# Altium project ts_20-Telemtry-Unit.PrjPcb
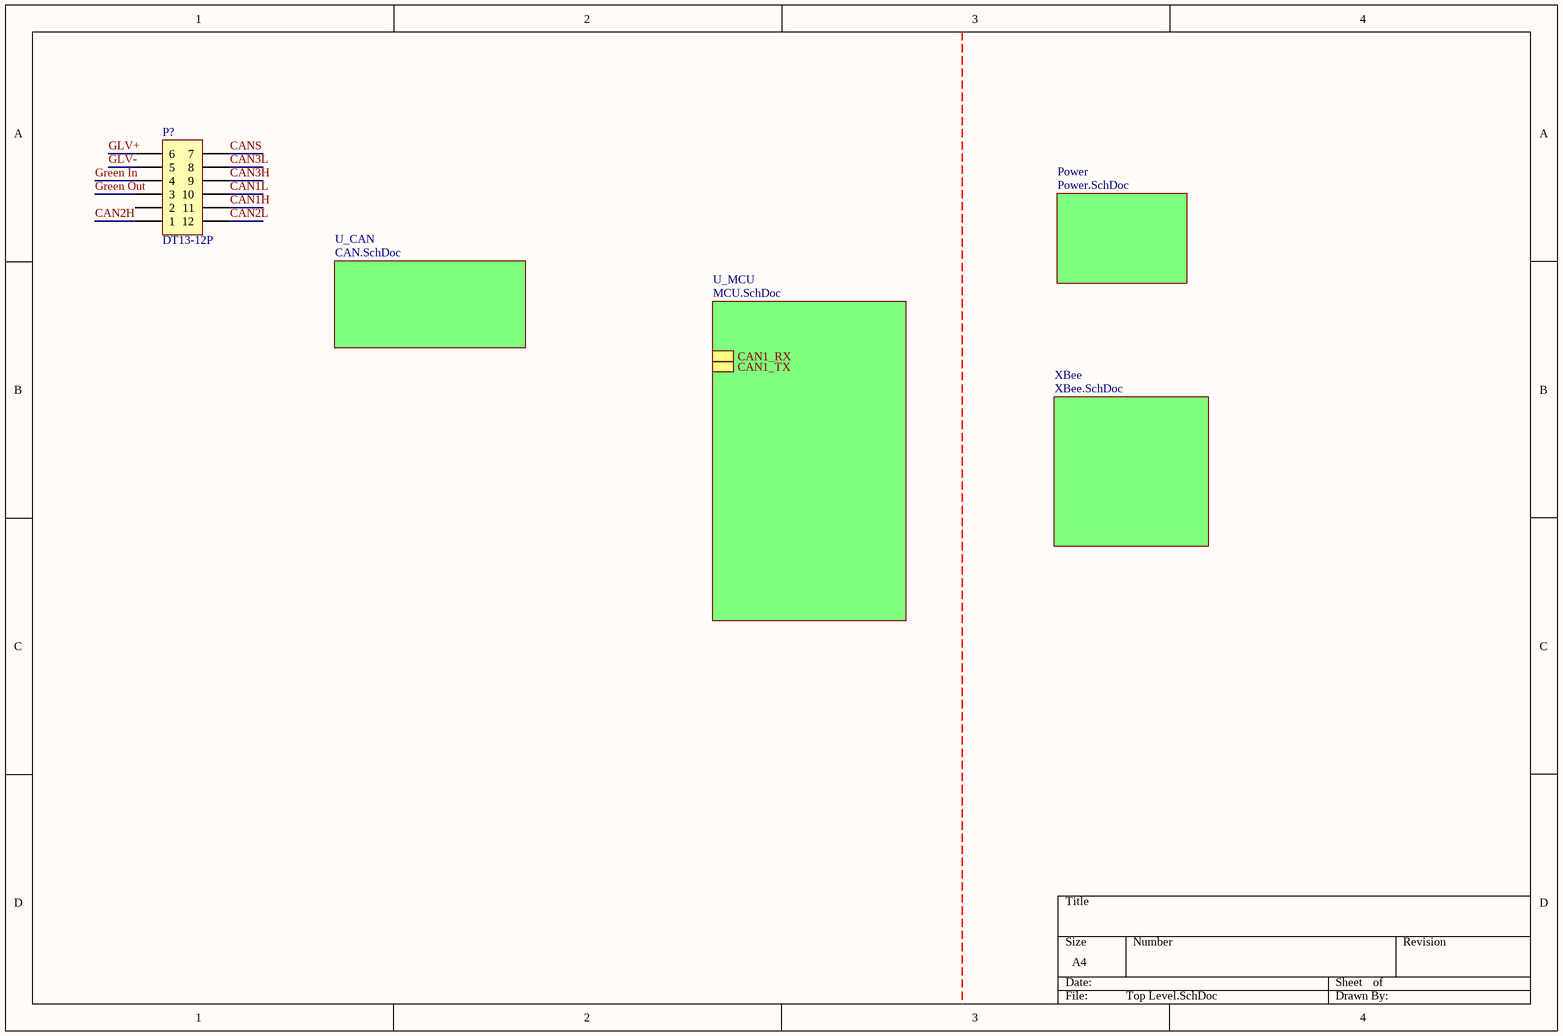
[diagram p0: Top Level.SchDoc]
5 sheets, 13 parts. Net scope: hierarchical (ports join the sheet entries above them; power ports are global).
Sheets:
  Top Level.SchDoc
    U_CAN = CAN.SchDoc
    U_MCU = MCU.SchDoc
    Power = Power.SchDoc
    XBee = XBee.SchDoc

## Sheet Top Level.SchDoc
size A4; SheetNumber: 1; SheetTotal: 5

### Parts
P?  DT13-12P  [DT13-12P]

### Sub-sheets
Power = Power.SchDoc: no entries
U_CAN = CAN.SchDoc: no entries
U_MCU = MCU.SchDoc: CAN1_RX, CAN1_TX
XBee = XBee.SchDoc: no entries

### Nets
CAN1H: P?.11
CAN1L: P?.10
CAN2H: P?.1
CAN2L: P?.12
CAN3H: P?.9
CAN3L: P?.8
CANS: P?.7
GLV+: P?.6
GLV-: P?.5
Green In: P?.4
Green Out: P?.3

Not connected (* = marked no-connect by the designer): P? 2

### Library data of the parts
P? = DT13-12P: Positions: 12; Pitch: 4.44mm; Row Spacing: 6.35mm; Angle: 90; Flange: Yes; Contact: Nickel; Part Number: DT13-12P; Digikey Part Number: 1734-1451-ND; Digikey Link: https://www.digikey.com.au/product-detail/en/te-connectivity-deutsch-connectors/DT13-12PA/1734-1451-ND/7220123

## Sheet CAN.SchDoc
size A4; SheetNumber: 2; SheetTotal: 2

## Sheet MCU.SchDoc
size A4; SheetNumber: 3; SheetTotal: 5
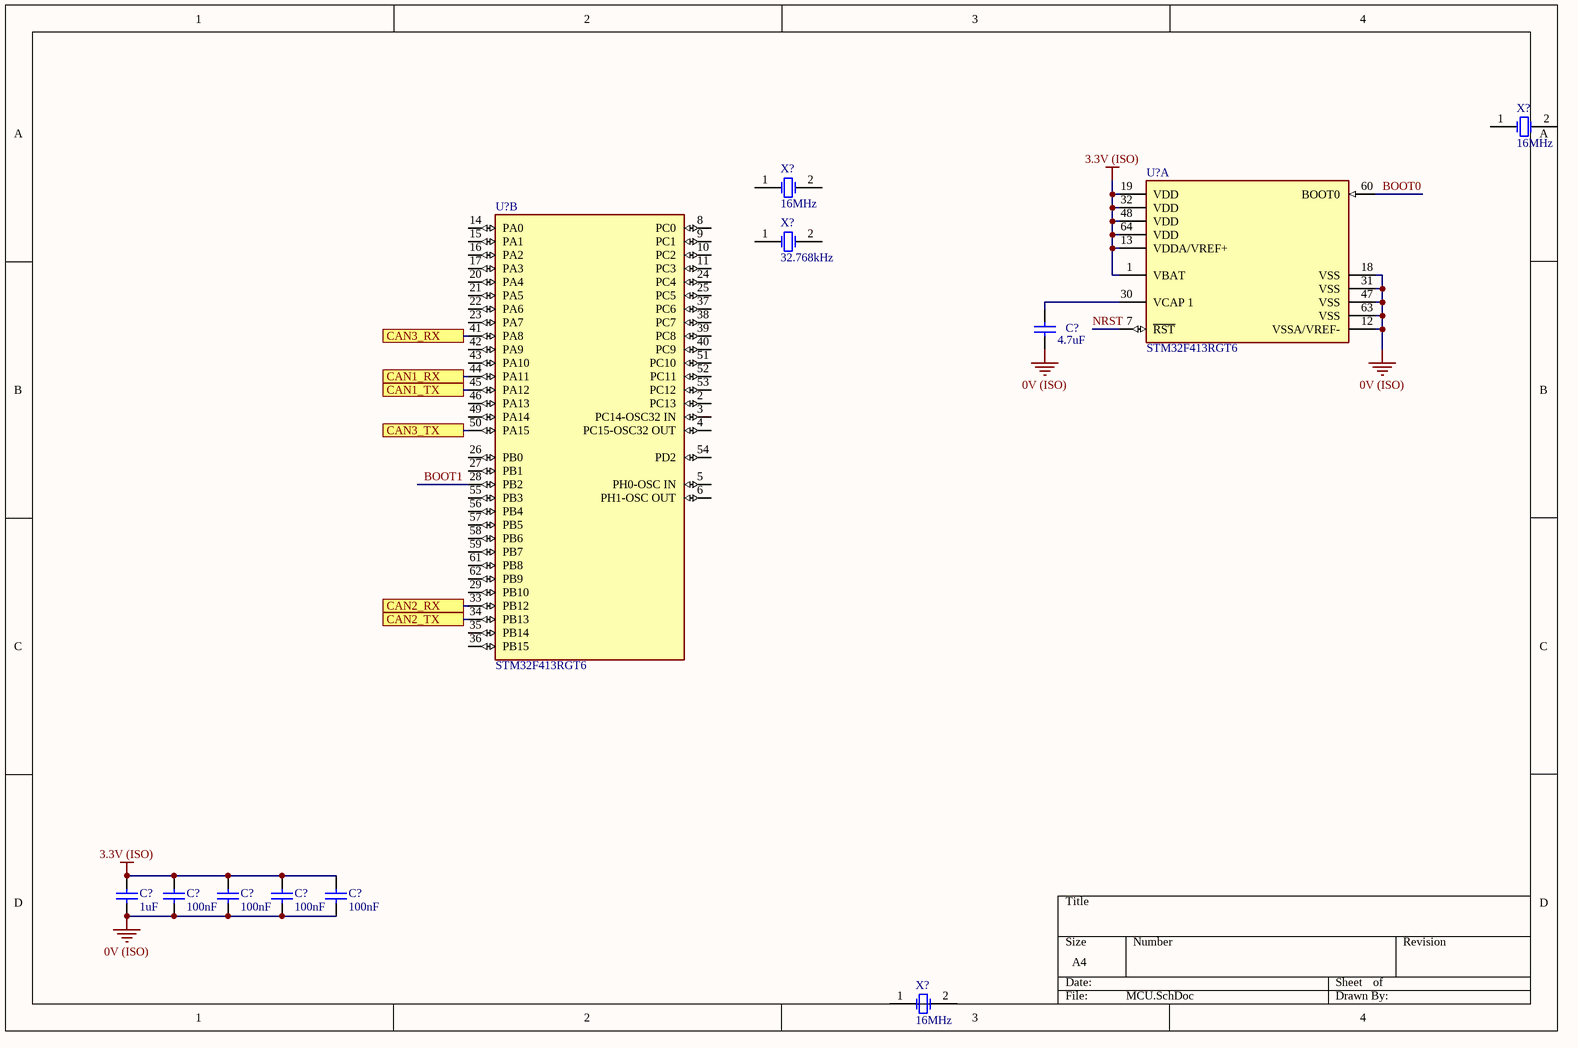
[diagram p1: MCU.SchDoc]

### Parts
(Parts that share a designator on the sheet are numbered #1, #2 ... from top to bottom, then left to right.)
C?#1  4.7uF  [0805]
C?#2  1uF  [0805]
C?#3  100nF  [0805]
C?#4  100nF  [0805]
C?#5  100nF  [0805]
C?#6  100nF  [0805]
U?#1  STM32F413RGT6  [FP-LQFP64-5W-MFG]  (part A of 2)
U?#2  STM32F413RGT6  [FP-LQFP64-5W-MFG]  (part B of 2)
X?#1  16MHz  [Abracon HC-49/US]
X?#2  16MHz  [Abracon HC-49/US]
X?#3  32.768kHz  [EPSON 2-SMD]
X?#4  16MHz  [Abracon HC-49/US]

### Ports
CAN1_RX, CAN1_TX, CAN2_RX, CAN2_TX, CAN3_RX, CAN3_TX

### Nets
0V (ISO): C?#1.2 C?#2.1 C?#3.1 C?#4.1 C?#5.1 C?#6.1 U?#1.12(VSSA/VREF-) U?#1.18(VSS) U?#1.31(VSS) U?#1.47(VSS) U?#1.63(VSS)
3.3V (ISO): C?#2.2 C?#3.2 C?#4.2 C?#5.2 C?#6.2 U?#1.1(VBAT) U?#1.13(VDDA/VREF+) U?#1.19(VDD) U?#1.32(VDD) U?#1.48(VDD) U?#1.64(VDD)
BOOT0: U?#1.60(BOOT0)
BOOT1: U?#2.28(PB2)
NRST: U?#1.7(~{RST})
NetC?#1_1: C?#1.1 U?#1.30(VCAP_1)
NetU?#2_33: U?#2.33(PB12) ; port CAN2_RX
NetU?#2_34: U?#2.34(PB13) ; port CAN2_TX
NetU?#2_41: U?#2.41(PA8) ; port CAN3_RX
NetU?#2_44: U?#2.44(PA11) ; port CAN1_RX
NetU?#2_45: U?#2.45(PA12) ; port CAN1_TX
NetU?#2_50: U?#2.50(PA15) ; port CAN3_TX

Not connected (* = marked no-connect by the designer): U?#2 2(PC13) 3(PC14-OSC32_IN) 4(PC15-OSC32_OUT) 5(PH0-OSC_IN) 6(PH1-OSC_OUT) 8(PC0) 9(PC1) 10(PC2) 11(PC3) 14(PA0) 15(PA1) 16(PA2) 17(PA3) 20(PA4) 21(PA5) 22(PA6) 23(PA7) 24(PC4) 25(PC5) 26(PB0) 27(PB1) 29(PB10) 35(PB14) 36(PB15) 37(PC6) 38(PC7) 39(PC8) 40(PC9) 42(PA9) 43(PA10) 46(PA13) 49(PA14) 51(PC10) 52(PC11) 53(PC12) 54(PD2) 55(PB3) 56(PB4) 57(PB5) 58(PB6) 59(PB7) 61(PB8) 62(PB9); X?#1 1(OSC1) 2(OSC2); X?#2 1(OSC1) 2(OSC2); X?#3 1(OSC1) 2(OSC2); X?#4 1(OSC1) 2(OSC2)

### Library data of the parts
C?#1 = GCM21BR61A475KA37L: Manufacturer: muRata; Tolerance: 10%; Material: X5R; Rated Voltage: 10V; Part Number: GCM21BR61A475KA37L; Value: 4.7uF; Digikey Part Number: DO NOT USE FOR NEW DESIGNS
C?#2 = AC0805KKX7R8BB105: Manufacturer: YAGEO; Tolerance: 10%; Material: X7R; Rated Voltage: 25V; Part Number: AC0805KKX7R8BB105; Value: 1uF; Digikey Part Number: DO NOT USE FOR NEW DESIGNS
C?#3-C?#6 = GCM21BR71E104KA37L: Manufacturer: muRata; Tolerance: 10%; Material: X7R; Rated Voltage: 25V; Part Number: GCM21BR71E104KA37L; Value: 100nF; Digikey Part Number: DO NOT USE FOR NEW DESIGNS
U?#1 U?#2 = STM32F413RGT6: IC MCU 32BIT 1MB FLASH 64LQFP; Manufacturer: STMicroelectronics; Max Supply Voltage: 3.6V; Number Of Uart Channels: 7; Data Bus Width: 32bits; Number Of Pwm Channels: 32; Max Junction Temp: +105°C; Number Of A/D Converters: 1; Core Architecture: ARM Cortex-M4; Number Of Timers/Counters: 15; Min Supply Voltage: 1.7V; Memory Size: 1MBytes; Standoff Height: 0.05mm; Number Of Spi Channels: 5; Number Of Adc Channels: 16; Number Of I2C Channels: 4; Ram Size: 320KBytes; Interface: I2C,SPI,UART,USART,CAN,USB,LIN,IrDA,I2S,Other; Frequency: 100MHz; Number Of I/Os: 50; Nominal Supply Current: 25-180mA; Ambient Temperature Range High: +85°C; Ipc Land Pattern Name: QFP50P1200X1200X160-64; Temperature Range High: +105°C; Lead Free: Yes; Ambient Temperature Range Low: -40°C; Digikey Description: IC MCU 32BIT 1MB FLASH 64LQFP; Device Class L3: Microcontrollers; Temperature: -40°C to +105°C; Temperature Range Low: -40°C; Number Of Cores: 1; ComponentLink2Description: Datasheet; Category: IC; Device Class L1: Integrated Circuits (ICs); Package: LQFP64-5W; Height: 1.6mm; ComponentLink2URL: http://www.st.com/content/ccc/resource/technical/document/datasheet/group3/f6/1d/4a/d9/f9/96/43/2a/DM00282249/files/DM00282249.pdf/jcr:content/translations/en.DM00282249.pdf; Manufacturer Part Number: STM32F413RGT6; RoHS: TRUE; Memory Type: FLASH; Number Of Usb Channels: 1; Device Class L2: Embedded Processors and Controllers; Automotive: No; Octopart: https://octopart.com/stm32f413rgt6-stmicroelectronics-76512522; Part Number: STM32F413RGT6; Digikey Part Number: 497-17011-ND; Digikey Link: https://www.digikey.com.au/product-detail/en/stmicroelectronics/STM32F413RGT6/497-17011-ND/6564703
X?#1 X?#2 X?#4 = ABLS-16.000MHZ-B4-T: Manufacturer: Abracon LLC; Load Capacitance: 18pF; ESR: 40R; Part Number: ABLS-16.000MHZ-B4-T; Value: 16MHz; Digikey Part Number: 535-10226-1-ND; Digikey Link: https://www.digikey.com/product-detail/en/abracon-llc/ABLS-16.000MHZ-B4-T/535-10226-1-ND/2184261
X?#3 = FC-135 32.7680KA-A5: Manufacturer: EPSON; Load Capacitance: 12.5pF; ESR: 70k; Part Number: FC-135 32.7680KA-A5; Value: 32.768kHz; Digikey Part Number: SER4103TR-ND; Digikey Link: https://www.digikey.com/product-detail/en/epson/FC-135-32.7680KA-A5/SER4103TR-ND/5259895

## Sheet Power.SchDoc
size A4; SheetNumber: 4; SheetTotal: 4

## Sheet XBee.SchDoc
size A4; SheetNumber: 5; SheetTotal: 5